# Altium schematic sheet loom-dummy-accumulator.SchDoc
size 297 x 209 mm
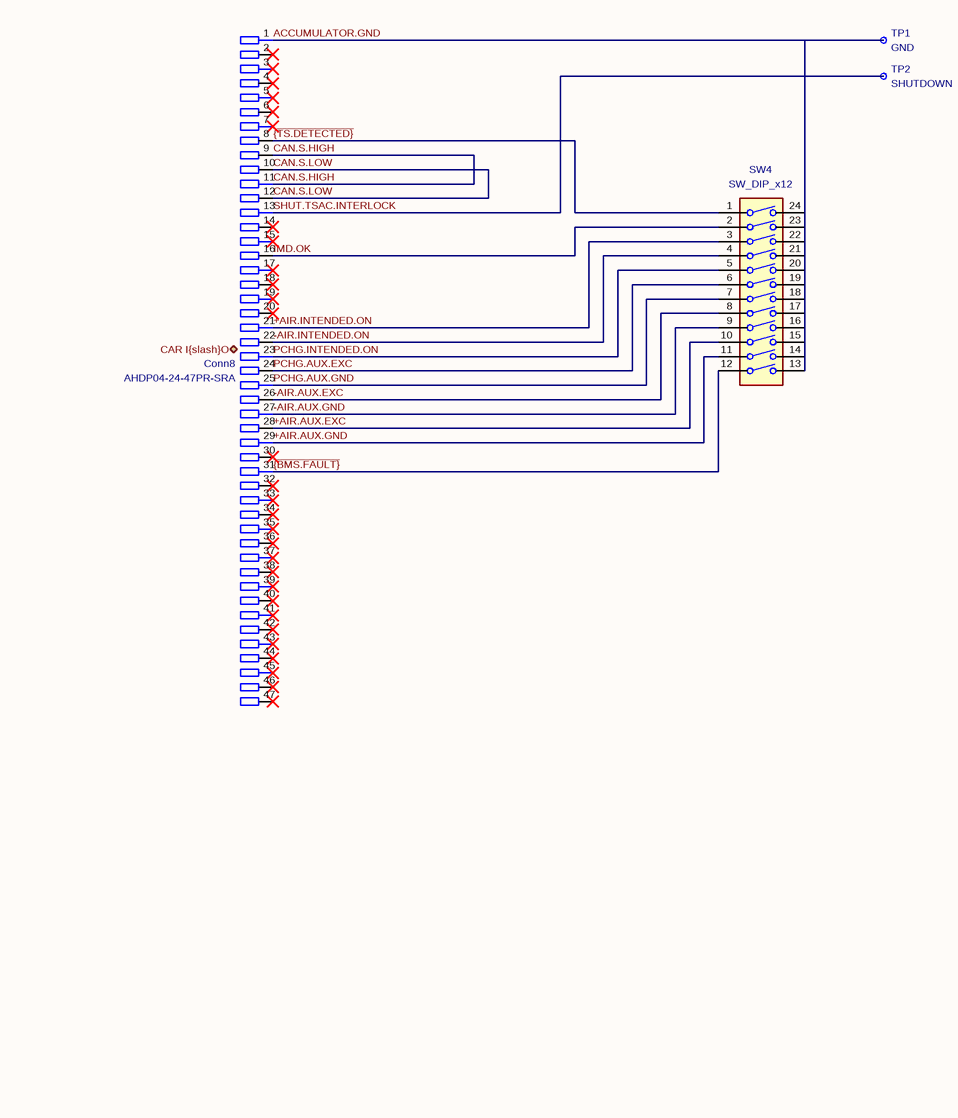
[diagram p0: loom-dummy-accumulator.SchDoc]

## Parts
Conn8  P/N: AHDP04-24-47PR-SRA  (hidden comment: AMPHENOL-47P-Pannel)
SW4  SW_DIP_x12
TP1  GND
TP2  SHUTDOWN

## Ports
CAR I{slash}O (bidir)

## Nets
+AIR.AUX.EXC: Conn8.28 SW4.10
+AIR.AUX.GND: Conn8.29 SW4.11
+AIR.INTENDED.ON: Conn8.21 SW4.3
-AIR.AUX.EXC: Conn8.26 SW4.8
-AIR.AUX.GND: Conn8.27 SW4.9
-AIR.INTENDED.ON: Conn8.22 SW4.4
ACCUMULATOR.GND: Conn8.1 SW4.13 SW4.14 SW4.15 SW4.16 SW4.17 SW4.18 SW4.19 SW4.20 SW4.21 SW4.22 SW4.23 SW4.24 TP1.1
CAN.S.HIGH: Conn8.9 Conn8.11
CAN.S.LOW: Conn8.10 Conn8.12
IMD.OK: Conn8.16 SW4.2
PCHG.AUX.EXC: Conn8.24 SW4.6
PCHG.AUX.GND: Conn8.25 SW4.7
PCHG.INTENDED.ON: Conn8.23 SW4.5
SHUT.TSAC.INTERLOCK: Conn8.13 TP2.1
~{{BMS.FAULT}}: Conn8.31 SW4.12
~{{TS.DETECTED}}: Conn8.8 SW4.1

Not connected (* = marked no-connect by the designer): Conn8 2* 3* 4* 5* 6* 7* 14* 15* 17* 18* 19* 20* 30* 32* 33* 34* 35* 36* 37* 38* 39* 40* 41* 42* 43* 44* 45* 46* 47*

## Notes on the sheet
- 1
- 2
- 3
- 4
- 5
- 6
- A
- B
- C
- D
- Title: LOOM - DUMMY ACCUMULATOR
- File: loom-dummy-accumulator.kicad_sch
- Sheet: /
- KiCad E.D.A.  kicad (5.1.4)-1
- Size: A4
- Date:
- Rev:
- Id: 1/1

## Library data of the parts
SW4 = SW_DIP_x12: Description: 12x DIP Switch, Single Pole Single Throw (SPST) switch, small symbol; Value: SW_DIP_x12
TP1 TP2 = TestPoint_Small: Description: test point
  TP1: Value: GND
  TP2: Value: SHUTDOWN
Conn8 = AMPHENOL-47P-Pannel: Value: AMPHENOL-47P-Pannel